# EAGLE board RFWBBoard (EAGLE 6.4)
REV: B; TITLE: Joshua
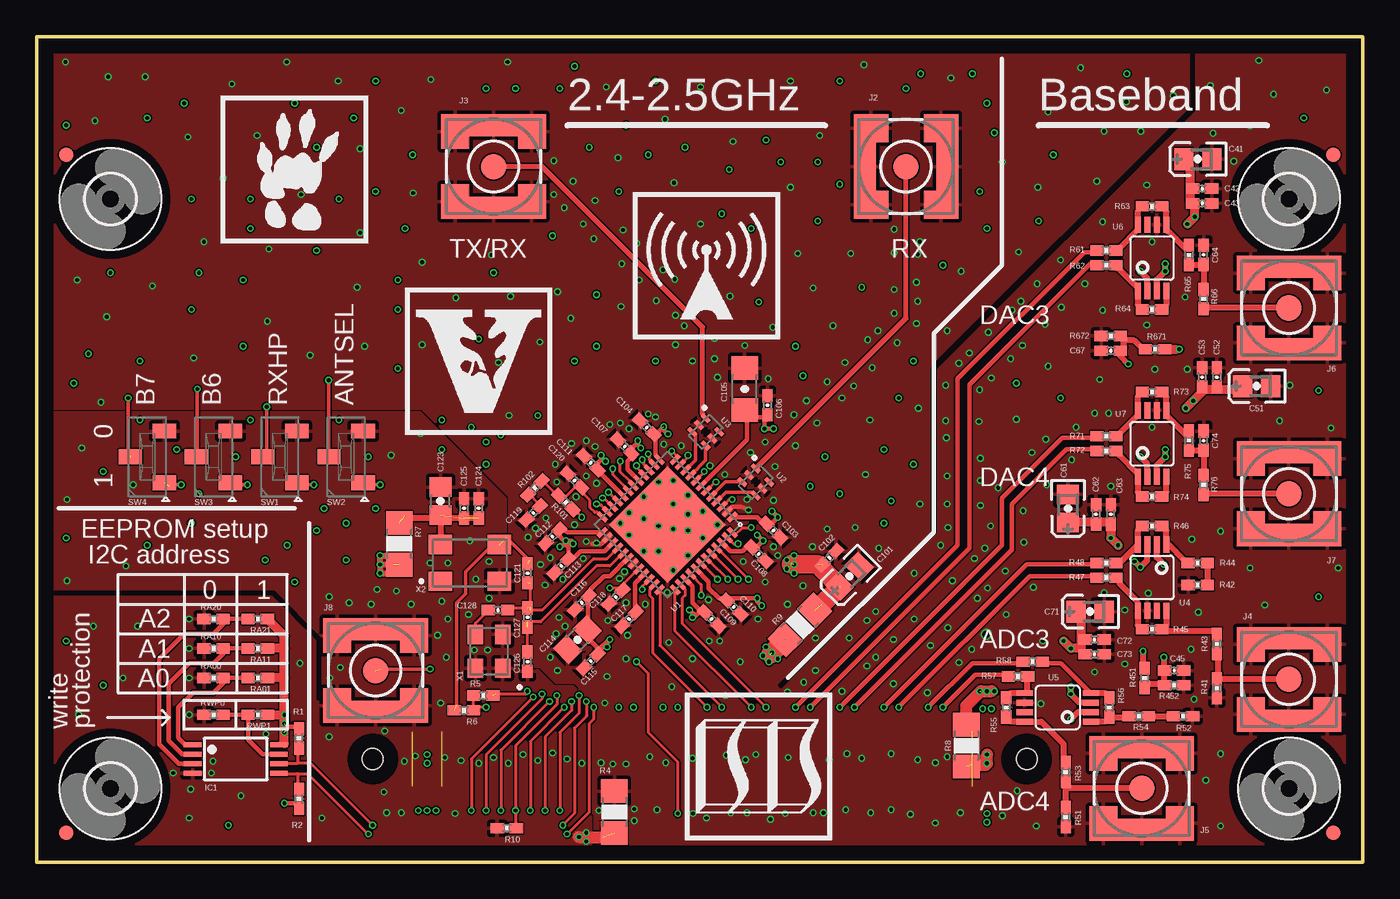
[diagram p7: board, top side]
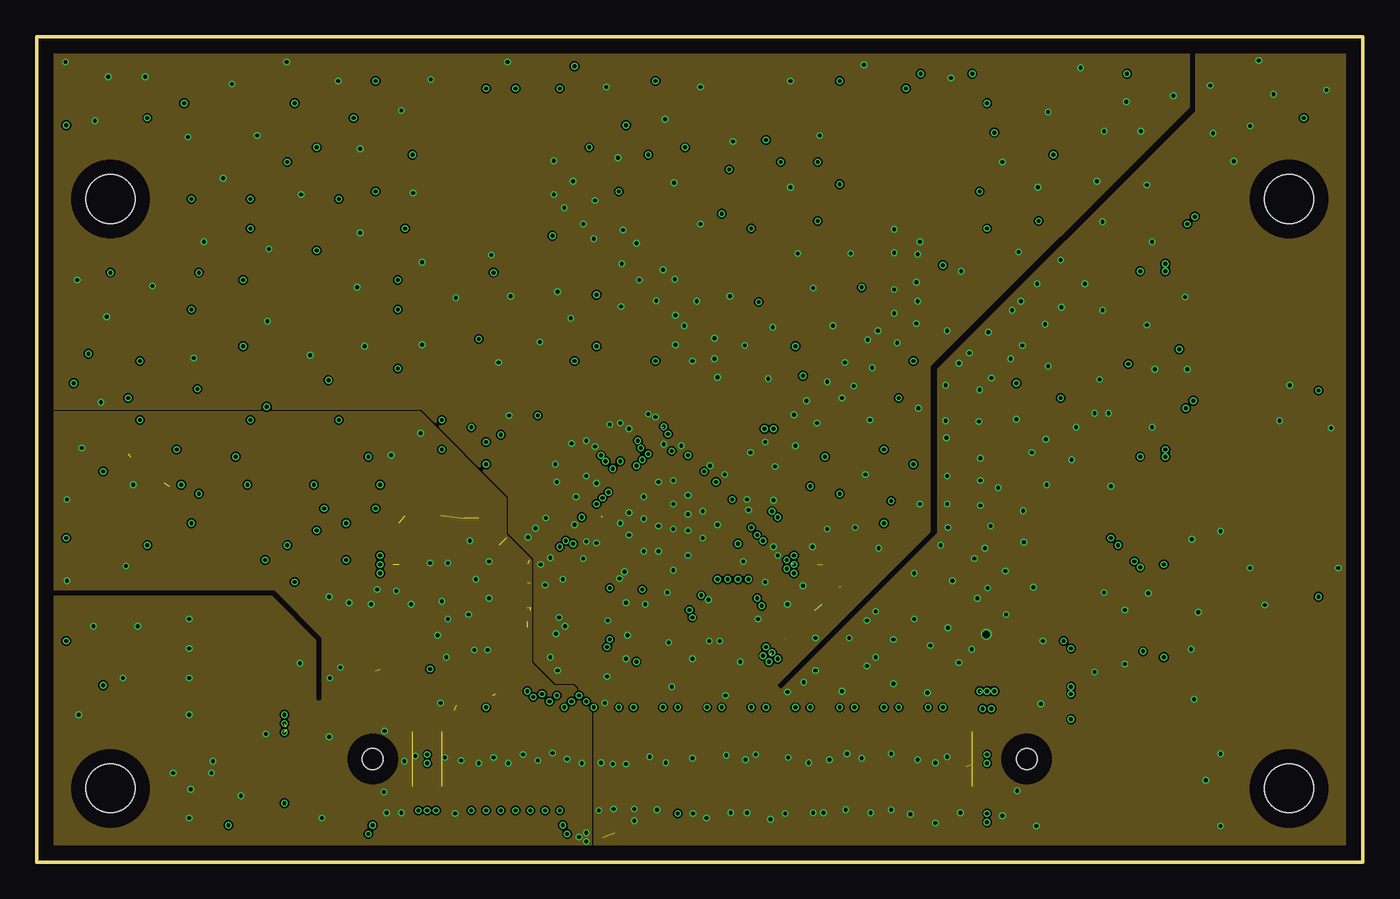
[diagram p8: board, inner layer GND1]
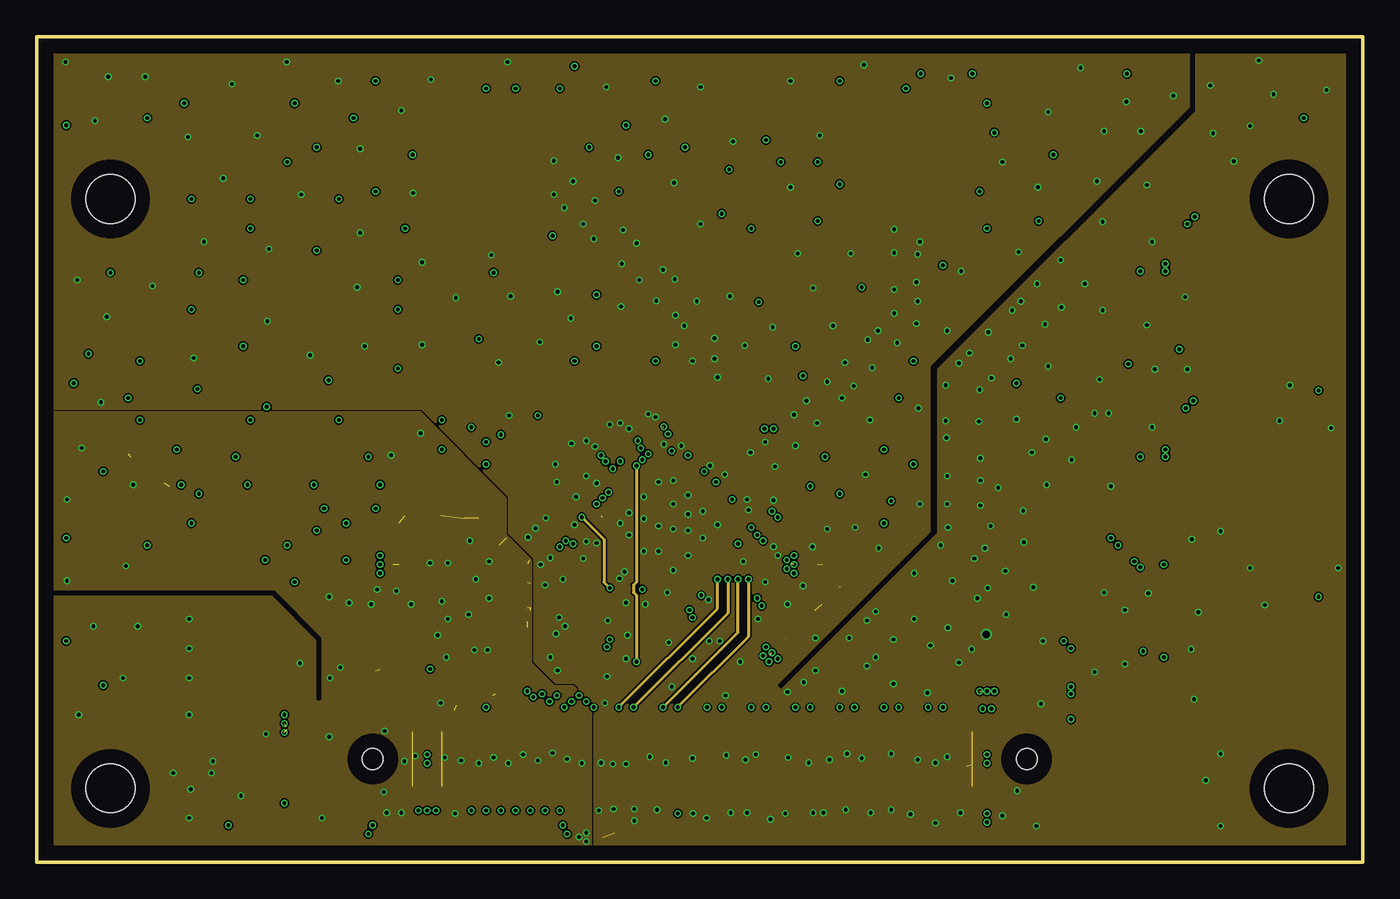
[diagram p9: board, inner layer SIGNAL2]
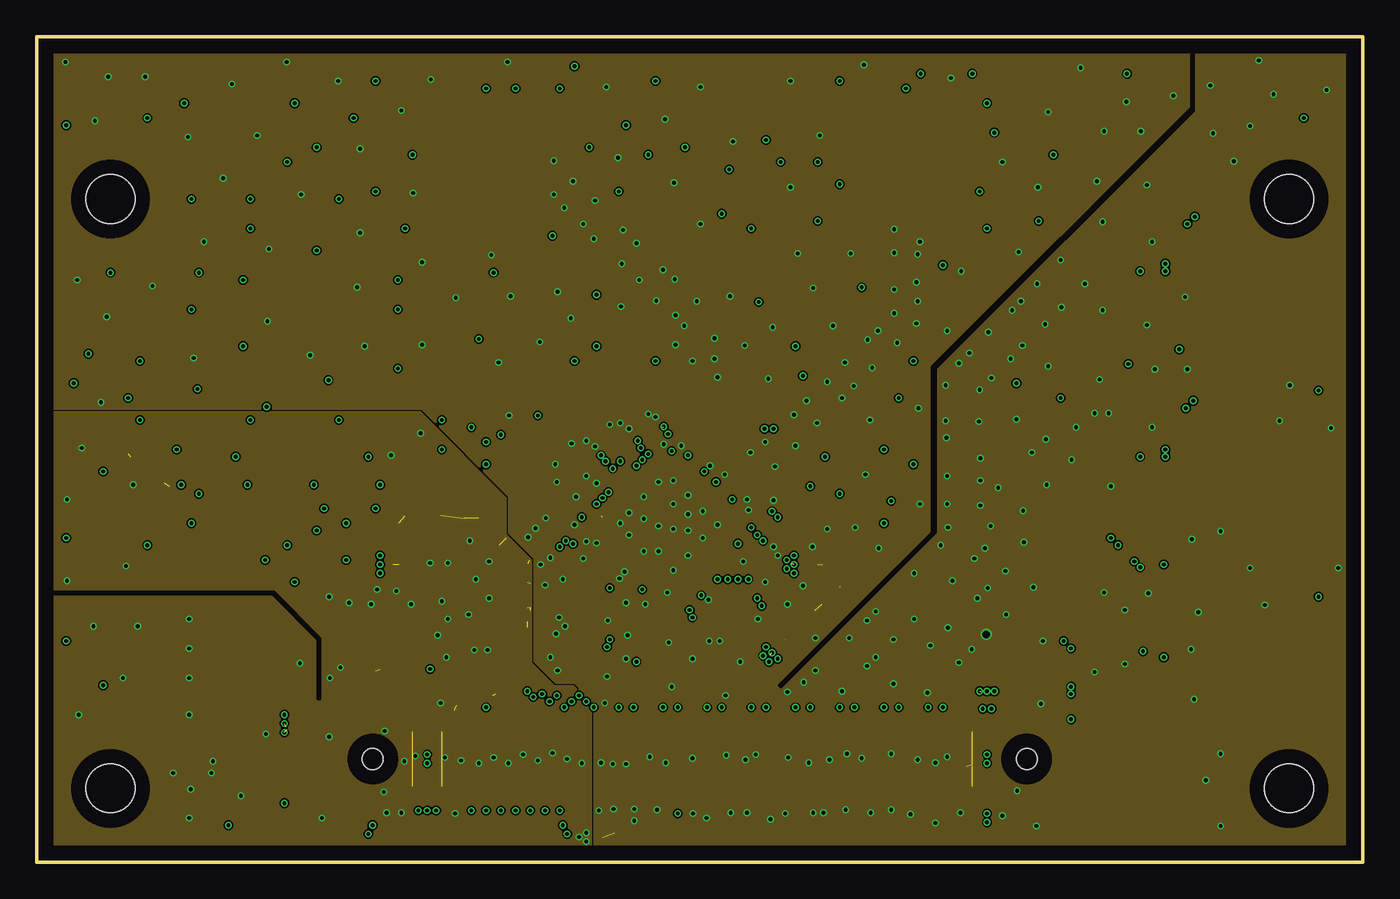
[diagram p10: board, inner layer GND2]
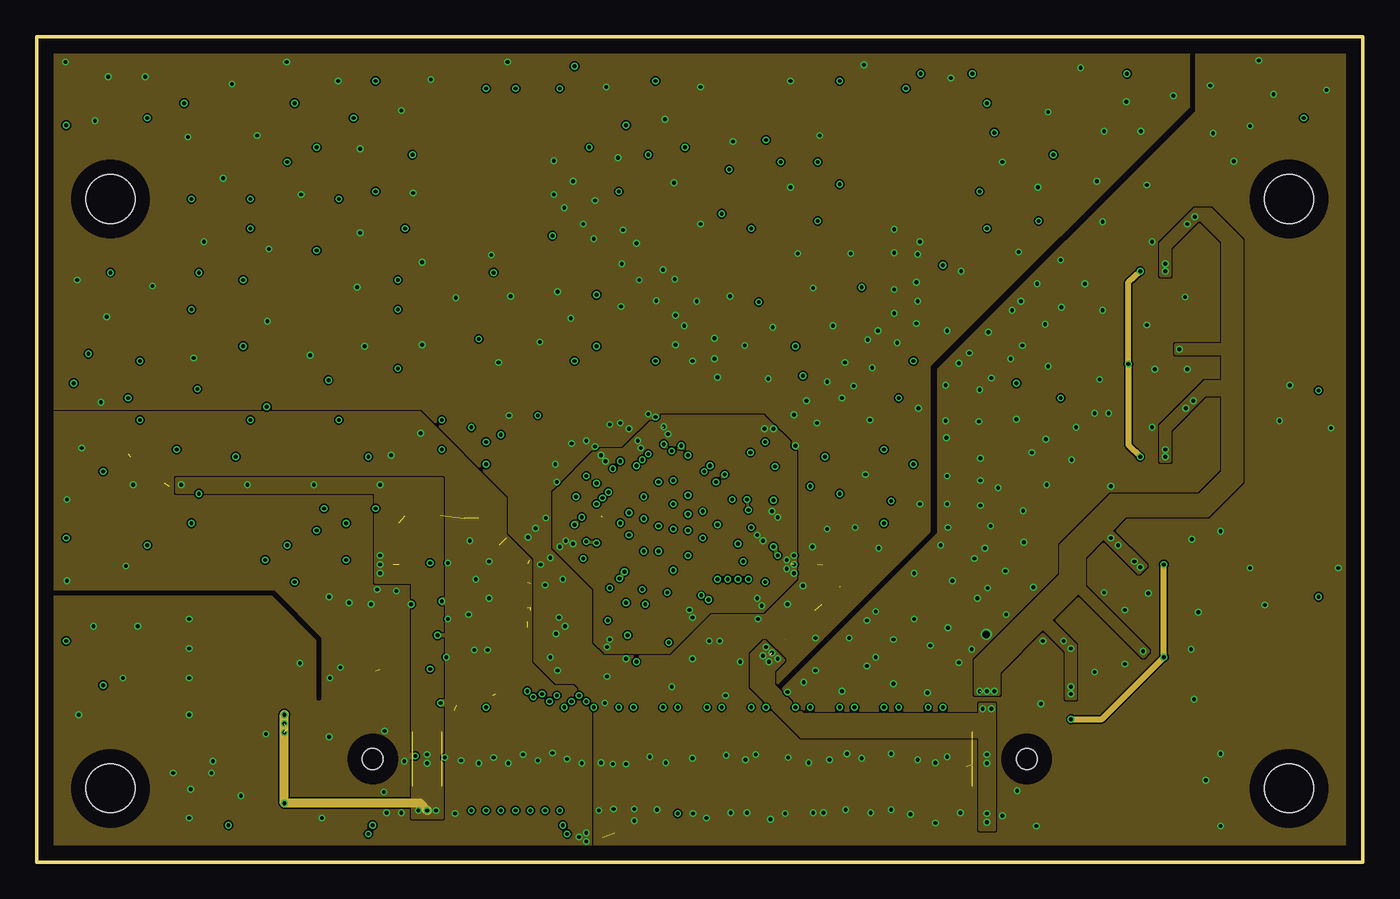
[diagram p11: board, inner layer SUPPLY]
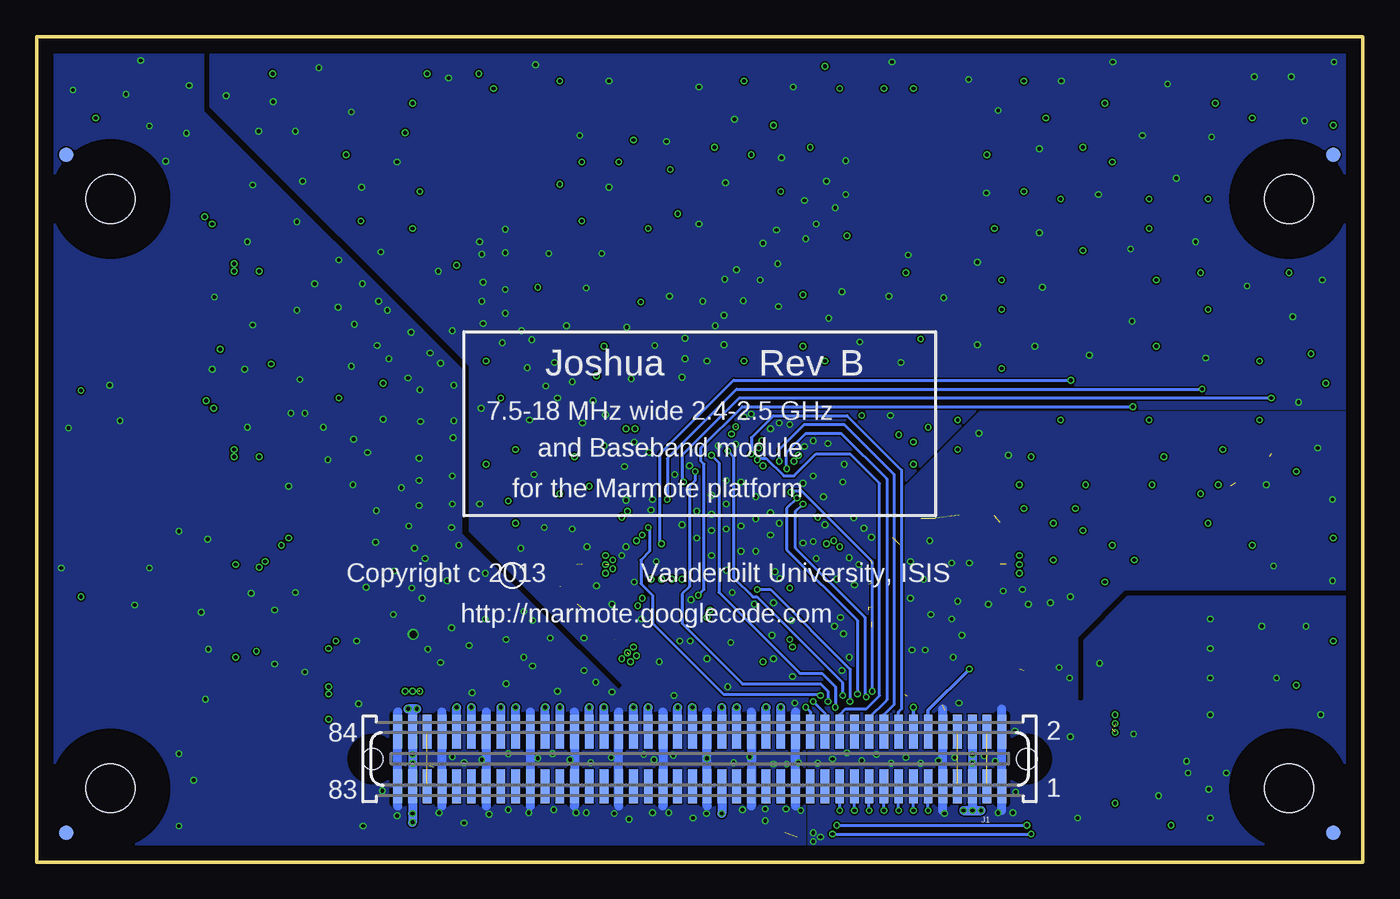
[diagram p12: board, bottom side, seen from below]

Size 90 x 56 mm. Coordinates in mm from the lower left corner, seen from the top.
Outline: 0,0 0,56 90,56 90,0 0,0
Copper layers (1*2*3+14*15*16): SIGNAL1 0.0356mm / dielectric 5mil / GND1 0.0356mm / dielectric 5mil / SIGNAL2 0.0356mm / dielectric 40mil / GND2 0.0356mm / dielectric 5mil / SUPPLY 0.0356mm / dielectric 5mil / GND3 0.0356mm
Design rules "default": minimum track width 4mil, minimum drill 8mil, track to track 4mil, track to pad 4mil, pad to pad 4mil, via to via 4mil, smd to smd 4mil, copper to edge 40mil, drill to drill 8mil, minimum pad ring 10mil, minimum via ring 4mil, stop-mask expansion 2mil, vias tented up to drill 0.5mm, thermal gap 10mil

## Footprints (pad centres in the part's own frame; a part is rotated, then mirrored left to right if it is on the bottom)
CPOL2012 = smd 1.3 x 1.5: + -0.95,0; - 0.95,0
C0402 = smd 0.9 x 0.7: 1 -0.65,0; 2 0.65,0
C1206 = smd 1.6 x 1.803: 1 -1.422,0; 2 1.422,0
C0805 = smd 1.3 x 1.5: 1 -0.95,0; 2 0.95,0
TSSOP8 = smd 0.35 x 1.2: 1 -0.975,-2.925; 2 -0.325,-2.925; 3 0.325,-2.925; 4 0.975,-2.925; 5 0.975,2.925; 6 0.325,2.925; 7 -0.325,2.925; 8 -0.975,2.925
71742-3003-BOT = smd 0.6 x 2.3: 1 -20.5,1.85; 2 -20.5,-1.85; 3 -19.5,1.85; 4 -19.5,-1.85; 5 -18.5,1.85; 6 -18.5,-1.85; 7 -17.5,1.85; 8 -17.5,-1.85; 9 -16.5,1.85; 10 -16.5,-1.85; 11 -15.5,1.85; 12 -15.5,-1.85; 13 -14.5,1.85; 14 -14.5,-1.85; 15 -13.5,1.85; 16 -13.5,-1.85; 17 -12.5,1.85; 18 -12.5,-1.85; 19 -11.5,1.85; 20 -11.5,-1.85; 21 -10.5,1.85; 22 -10.5,-1.85; 23 -9.5,1.85; 24 -9.5,-1.85; 25 -8.5,1.85; 26 -8.5,-1.85; 27 -7.5,1.85; 28 -7.5,-1.85; 29 -6.5,1.85; 30 -6.5,-1.85; 31 -5.5,1.85; 32 -5.5,-1.85; 33 -4.5,1.85; 34 -4.5,-1.85; 35 -3.5,1.85; 36 -3.5,-1.85; 37 -2.5,1.85; 38 -2.5,-1.85; 39 -1.5,1.85; 40 -1.5,-1.85; 41 -0.5,1.85; 42 -0.5,-1.85; 43 0.5,1.85; 44 0.5,-1.85; 45 1.5,1.85; 46 1.5,-1.85; 47 2.5,1.85; 48 2.5,-1.85; 49 3.5,1.85; 50 3.5,-1.85; 51 4.5,1.85; 52 4.5,-1.85; 53 5.5,1.85; 54 5.5,-1.85; 55 6.5,1.85; 56 6.5,-1.85; 57 7.5,1.85; 58 7.5,-1.85; 59 8.5,1.85; 60 8.5,-1.85; 61 9.5,1.85; 62 9.5,-1.85; 63 10.5,1.85; 64 10.5,-1.85; 65 11.5,1.85; 66 11.5,-1.85; 67 12.5,1.85; 68 12.5,-1.85; 69 13.5,1.85; 70 13.5,-1.85; 71 14.5,1.85; 72 14.5,-1.85; 73 15.5,1.85; 74 15.5,-1.85; 75 16.5,1.85; 76 16.5,-1.85; 77 17.5,1.85; 78 17.5,-1.85; 79 18.5,1.85; 80 18.5,-1.85; 81 19.5,1.85; 82 19.5,-1.85; 83 20.5,1.85; 84 20.5,-1.85 | hole 1.4: -22.2,0; 22.2,0
SMA-SMD = smd 1.73 x 1.73: 1 0,0 | smd 2.35 x 1.9: 2@1 -2.375,2.6; 2@2 -2.375,-2.6; 2@3 2.375,-2.6; 2@4 2.375,2.6 | smd 1.5 x 3.4: 2@5 -2.8,0; 2@6 2.8,0
3,3 = hole 3.3: 0,0
FIDUCIAL-1X2 = smd 1 x 1: 1 0,0
R0402 = smd 0.9 x 0.7: 1 -0.65,0; 2 0.65,0
R1206 = smd 1.6 x 1.803: 1 -1.422,0; 2 1.422,0
SWITCH-DIP-CJS = smd 1 x 1.6: 1 -1.75,-1.15; 2 0,1.15; 3 1.75,-1.15
TQFN-48 = smd 0.8 x 0.3: 1 -3.5,2.75; 2 -3.5,2.25; 3 -3.5,1.75; 4 -3.5,1.25; 5 -3.5,0.75; 6 -3.5,0.25; 7 -3.5,-0.25; 8 -3.5,-0.75; 9 -3.5,-1.25; 10 -3.5,-1.75; 11 -3.5,-2.25; 12 -3.5,-2.75; 25 3.5,-2.75; 26 3.5,-2.25; 27 3.5,-1.75; 28 3.5,-1.25; 29 3.5,-0.75; 30 3.5,-0.25; 31 3.5,0.25; 32 3.5,0.75; 33 3.5,1.25; 34 3.5,1.75; 35 3.5,2.25; 36 3.5,2.75 | smd 0.3 x 0.8: 13 -2.75,-3.5; 14 -2.25,-3.5; 15 -1.75,-3.5; 16 -1.25,-3.5; 17 -0.75,-3.5; 18 -0.25,-3.5; 19 0.25,-3.5; 20 0.75,-3.5; 21 1.25,-3.5; 22 1.75,-3.5; 23 2.25,-3.5; 24 2.75,-3.5; 37 2.75,3.5; 38 2.25,3.5; 39 1.75,3.5; 40 1.25,3.5; 41 0.75,3.5; 42 0.25,3.5; 43 -0.25,3.5; 44 -0.75,3.5; 45 -1.25,3.5; 46 -1.75,3.5; 47 -2.25,3.5; 48 -2.75,3.5 | smd 5.6 x 5.6: 49 0,0
LDB21-FOOTPRINT = smd 0.7 x 0.3: 1 -0.65,0.65; 2 -0.65,0; 3 -0.65,-0.65; 4 0.65,-0.65; 5 0.65,0; 6 0.65,0.65
MSOP8 = smd 0.4 x 1.1: 1 -0.975,-2.25; 2 -0.325,-2.25; 3 0.325,-2.25; 4 0.975,-2.25; 5 0.975,2.25; 6 0.325,2.25; 7 -0.325,2.25; 8 -0.975,2.25
CX3225SB = smd 1.3 x 1.05: 1 -1.15,-0.925; 2 1.15,-0.925; 3 1.15,0.925; 4 -1.15,0.925
FOX924 = smd 1.6 x 1.3: 1 -2,-1.25; 2 2,-1.25; 3 2,1.25; 4 -2,1.25

## Placement (x,y rotation side)
C41  10uF  [CPOL2012]  78.8,47.7 0 top
C42  100nF  [C0402]  79.1,45.7 0 top
C43  10nF  [C0402]  79.1,44.7 0 top
C45  100nF  [C0402]  77.2,13 0 top
C51  10uF  [CPOL2012]  82.8,32.3 0 top
C52  100nF  [C0402]  80.1,32.9 90 top
C53  10nF  [C0402]  79.1,32.9 90 top
C61  10uF  [CPOL2012]  70,24 90 top
C62  100nF  [C0402]  71.9,23.6 90 top
C63  10nF  [C0402]  72.9,23.6 90 top
C64  100pF  [C0402]  79.2,41.2 90 top
C67  100nF  [C0402]  72.9,34.7 180 top
C71  10uF  [CPOL2012]  71.5,17 0 top
C72  100nF  [C0402]  71.8,15.1 0 top
C73  10nF  [C0402]  71.8,14.1 0 top
C74  100pF  [C0402]  79.2,28.6 90 top
C101  10uF  [CPOL2012]  55.15,19.4 45 top
C102  100nF  [C0402]  53.8,20.65 45 top
C103  100pF  [C0402]  50,22.5 315 top
C104  DNP  [C0402]  41.4,29.5 135 top
C105  10uF  [C1206]  48.05,32.1 270 top
C106  100pF  [C0402]  49.6,31 270 top
C107  100pF  [C0402]  39.9,28.2 135 top
C108  100pF  [C0402]  49,20.9 315 top
C109  10nF  [C0402]  45.8,16.5 315 top
C110  10nF  [C0402]  47.3,17.3 315 top
C111  10nF  [C0402]  37.6,27.1 135 top
C112  10nF  [C0402]  35,22.1 225 top
C113  10nF  [C0402]  35.6,20.1 225 top
C114  10uF  [C0805]  36.7,15.1 225 top
C115  100nF  [C0402]  37.6,13.65 225 top
C116  100pF  [C0402]  37,17.6 225 top
C117  100nF  [C0402]  40.2,16.5 225 top
C118  68pF  [C0402]  39.3,18 225 top
C119  2200pF  [C0402]  33.7,23.7 225 top
C120  100pF  [C0402]  36.5,25.9 135 top
C121  1000pF  [C0402]  33.3,19.6 90 top
C123  10uF  [C0805]  27.4,24.5 90 top
C124  100nF  [C0402]  30,24 90 top
C125  100pF  [C0402]  29,24 90 top
C126  18pF  [C0402]  33.3,13.6 90 top
C127  33pF  [C0402]  33.3,16.6 90 top
C128  1000pF  [C0402]  31.3,17.1 0 top
IC1  24LC025ST  [TSSOP8]  13.5,7 270 top
J1  CON-71742-3003-BOT  [71742-3003-BOT]  45,7 180 bottom
J2  SMA-SMD  [SMA-SMD]  59,47.2 0 top
J3  SMA-SMD  [SMA-SMD]  31,47.2 90 top
J4  SMA-SMD  [SMA-SMD]  85,12.4 90 top
J5  SMA-SMD  [SMA-SMD]  75,5 90 top
J6  SMA-SMD  [SMA-SMD]  85,37.6 90 top
J7  SMA-SMD  [SMA-SMD]  85,25 90 top
J8  SMA-SMD  [SMA-SMD]  23,13 90 top
LOGO4  LOGO-ISIS-600MIL-10MM-SS  [LOGO-ISIS-10MM-SILKSCREEN]  44,1.5 0 top
LOGO5  LOGO-VANDERBILT-600MIL-10MM-SS  [LOGO-VANDERBILT-10MM-SILKSCREEN]  25,29 0 top
LOGO6  LOGO-MARMOTE-600MIL-10MM-SS  [LOGO-MARMOTE-10MM-SILKSCREEN]  12.5,42 0 top
LOGO7  LOGO-RADIO-3-600MIL-10MM-SS  [LOGO-RADIO-FILLED-10MM-SILKSCREEN]  40.5,35.5 0 top
M1  MOUNT-HOLE3.3  [3,3]  5,45 0 top
M2  MOUNT-HOLE3.3  [3,3]  85,45 0 top
M3  MOUNT-HOLE3.3  [3,3]  5,5 0 top
M4  MOUNT-HOLE3.3  [3,3]  85,5 0 top
M5  FIDUCIAL1X2  [FIDUCIAL-1X2]  2,2 0 top
M6  FIDUCIAL1X2  [FIDUCIAL-1X2]  2,48 0 top
M7  FIDUCIAL1X2  [FIDUCIAL-1X2]  88,48 0 top
M8  FIDUCIAL1X2  [FIDUCIAL-1X2]  88,2 0 top
M9  FIDUCIAL1X2  [FIDUCIAL-1X2]  2,48 0 bottom
M10  FIDUCIAL1X2  [FIDUCIAL-1X2]  88,48 0 bottom
M11  FIDUCIAL1X2  [FIDUCIAL-1X2]  2,2 0 bottom
M12  FIDUCIAL1X2  [FIDUCIAL-1X2]  88,2 0 bottom
R1  4.7k  [R0402]  17.8,8.4 90 top
R2  4.7k  [R0402]  17.8,4.3 270 top
R4  DNP  [R1206]  39.2,3.4 90 top
R5  0  [R0402]  30.3,11.3 0 top
R6  0  [R0402]  29,10.3 180 top
R7  0  [R1206]  24.6,21.6 270 top
R8  0  [R1206]  63.1,7.9 90 top
R9  0  [R1206]  51.8,16.1 45 top
R10  30k  [R0402]  31.9,2.3 180 top
R41  10k  [R0402]  80.1,11.8 90 top
R42  10k  [R0402]  78.8,18.8 0 top
R43  1.58k  [R0402]  80.1,14.8 90 top
R44  1.58k  [R0402]  78.8,20.3 180 top
R45  1.3k  [R0402]  75.7,15.8 180 top
R46  1.3k  [R0402]  75.7,22.8 180 top
R47  49.9  [R0402]  72.6,19.3 180 top
R48  49.9  [R0402]  72.6,20.3 180 top
R51  10k  [R0402]  69.85,3.05 90 top
R52  10k  [R0402]  77.8,9.9 180 top
R53  1.58k  [R0402]  69.85,6.1 90 top
R54  1.58k  [R0402]  74.8,9.9 180 top
R55  1.3k  [R0402]  65.8,10.5 90 top
R56  1.3k  [R0402]  72.8,10.5 90 top
R57  49.9  [R0402]  66.6,12.6 180 top
R58  49.9  [R0402]  67.6,13.6 180 top
R61  40.2k  [R0402]  72.6,41.5 0 top
R62  40.2k  [R0402]  72.6,40.5 0 top
R63  40.2k  [R0402]  75.7,44.5 0 top
R64  40.2k  [R0402]  75.7,37.5 0 top
R65  24.9  [R0402]  78.2,41.2 270 top
R66  24.9  [R0402]  79.2,38.2 270 top
R71  40.2k  [R0402]  72.6,28.9 0 top
R72  40.2k  [R0402]  72.6,27.9 0 top
R73  40.2k  [R0402]  75.7,31.9 0 top
R74  40.2k  [R0402]  75.7,24.8 0 top
R75  24.9  [R0402]  78.2,28.6 270 top
R76  24.9  [R0402]  79.2,25.6 270 top
R101  750  [R0402]  35.9,24.4 315 top
R102  1.2k  [R0402]  33.8,25.4 225 top
R451  10k  [R0402]  75.2,12.5 90 top
R452  10k  [R0402]  77.2,12 180 top
R671  10k  [R0402]  75.9,34.8 0 top
R672  10k  [R0402]  72.9,35.7 0 top
RA00  0  [R0402]  12,12.5 0 top
RA01  DNP  [R0402]  15,12.5 180 top
RA10  0  [R0402]  12,14.5 0 top
RA11  DNP  [R0402]  15,14.5 180 top
RA20  0  [R0402]  12,16.5 0 top
RA21  0  [R0402]  15,16.5 180 top
RWP0  0  [R0402]  12,10 0 top
RWP1  DNP  [R0402]  15,10 180 top
SW1  SWITCH-CJS-1200TA  [SWITCH-DIP-CJS]  16.5,27.5 90 top
SW2  SWITCH-CJS-1200TA  [SWITCH-DIP-CJS]  21,27.5 90 top
SW3  SWITCH-CJS-1200TA  [SWITCH-DIP-CJS]  12,27.5 90 top
SW4  SWITCH-CJS-1200TA  [SWITCH-DIP-CJS]  7.5,27.5 90 top
U1  MAX2830IPC-7351  [TQFN-48]  42.8,22.9 225 top
U2  LDB212G4010C-001  [LDB21-FOOTPRINT]  48.8,25.8 315 top
U3  LDB212G4010C-001  [LDB21-FOOTPRINT]  45.4,29.2 315 top
U4  AD8132MSOP8  [MSOP8]  75.7,19.3 180 top
U5  AD8132MSOP8  [MSOP8]  69.3,10.5 90 top
U6  AD8132MSOP8  [MSOP8]  75.7,41 0 top
U7  AD8132MSOP8  [MSOP8]  75.7,28.4 0 top
X1  CX3225SB  [CX3225SB]  30.7,14.3 90 top
X2  FOX924B  [FOX924]  29.4,20.3 0 top

## Tracks (layer width: path | path; a pad name or v marks a point on that pad's centre or on a via)
!CS  (via drill 0.25)
  SIGNAL1 0.203: v41.1,27.3 41.2,27.2 41.2,27 41.4,26.8 U1.15
  GND3 0.203: v41.1,27.3 41,27.4 40.5,27.4 39.3,26.2 38.6,26.2 37.1,27.7 34.8,27.7 32.8,25.7 32.8,11.3 33.7,10.4 35.1,10.4 35.5,10 J1.24
!SHDN  (via drill 0.25)
  SIGNAL1 0.203: v43.1,27.9 43.5,27.5 U1.12 | v35.3,11.3 35.3,10.7 32.5,7.9 v32.5,3.5 32.5,2.35 R10.1
  GND3 0.203: v43.1,27.9 42.7,27.5 42.7,19.3 41.4,18 41.1,18 35.3,12.2 v35.3,11.3 | v32.5,3.5 J1.17
A0
  SIGNAL1 0.305: RA01.2 RA00.2 12.65,12.15 12,11.5 10.6,11.5 9.6,10.5 9.6,8.45 10.05,8 10.15,8 10.18,7.97 IC1.1
A1
  SIGNAL1 0.305: RA11.2 RA10.2 12.65,14.15 12,13.5 10.35,13.5 8.95,12.1 8.95,8.25 9.88,7.33 IC1.2
A1V5  (1 unrouted)
A2
  SIGNAL1 0.305: RA21.2 RA20.2 12.65,16.15 12,15.5 10,15.5 8.3,13.8 8.3,8 9.62,6.67 IC1.3
A3V3  (via drill 0.25, 0.25 pad 0.25)  (3 unrouted)
  SIGNAL1 0.813: 63.5,6.6 64.4,6.6 v64.5,6.7 v64.5,7.3
  SIGNAL1 1.27: R9.1 49.8,14.1
  GND3 0.61: J1.82 J1.81 v64.5,3.3 v64.5,2.7 | v64.2,10.4 v64.8,10.4 64.5,10.4 64.5,9.85
  other vias: 49.5,14.6 50.3,13.8 49.3,14 49.7,13.6 49.9,14.2
  pour SUPPLY: 65,10.7 65,2.2 64,2.2 64,8.5 51.9,8.5 48.5,11.9 48.5,14.1 49.4,15 50.7,13.7 50,13 50,12 52,10 64,10 64,10.7
A3V3_BB  (via drill 0.25, 0.25 pad 0.25)  (1 unrouted)
  SIGNAL1 0.203: C62.1 C63.1 | 72.9,23.1 C63.1 | C63.1 72.9,22.5 | R451.2 75.1,13.5 | 75.1,14.1 v75.1,14.3 | C72.1 70.9,15 | 70.9,14.5 C73.1 | 70.9,16.9 C71.+ | C51.+ 81.4,32.1 | C52.1 C53.1 79.3,32.1 | v77.55,34.8 77.3,34.8 | 76.9,34.8 R671.2 | 78.6,44.5 C43.1 78.3,44.9 C42.1 | 78.3,47 C41.+ | 70.2,23.1 C61.+
  SIGNAL1 0.406: v76.6,40.6 v76.6,40.1 76.03,39.52 U6.3 | v76.6,28 v76.6,27.5 76.03,26.93 U7.3 | v74.5,20.4 v74.9,20 75.38,20.48 U4.3 | v70.2,11.9 v70.2,11.4 70.78,10.82 U5.3 | 75.1,13.5 75.1,14.1
  SIGNAL1 0.61: 76.9,34.8 77.3,34.8 | v78.1,43.3 v78.6,43.8 78.6,44.5 | 78.3,44.9 78.3,47 | 81.4,32.1 79.3,32.1 v78.5,31.3 v78,30.8 | 70.2,23.1 72.9,23.1 | 72.9,22.5 v72.9,22 v73.4,21.5 | 70.9,16.9 70.9,15 70.9,14.5 v70.2,14.5 v69.7,15
  SIGNAL1 0.813: R8.2 63.1,10.6 64.1,11.6 64.8,11.6
  other vias: 64.5,11.6 64,11.6 65,11.6
  pour SUPPLY: 76.9,39.8 76.3,39.8 76.3,42 78.6,44.3 79.7,44.3 81.8,42.2 81.8,25.8 79.5,23.5 73.9,23.5 72.9,22.5 75.3,20.1 74.8,19.6 72.4,22 71.1,20.7 71.1,18.7 75.5,14.3 75.1,13.9 70.7,18.3 68.8,16.4 70.5,14.7 70.5,11.1 69.9,11.1 69.9,14.3 68.3,15.9 65.3,12.9 65.3,11.4 63.7,11.4 63.7,13.7 69.5,19.5 69.5,21.5 72.9,24.9 78.9,24.9 80.5,26.5 80.5,31.7 79.3,31.7 76.9,29.3 76.9,27.2 76.3,27.2 76.3,29.6 79.3,32.6 80.5,32.6 80.5,34.5 77.3,34.5 77.3,35.1 80.5,35.1 80.5,42.1 79,43.6 78.8,43.6 76.9,41.7
A3V3_RF  (via drill 0.25)  (5 unrouted)
  SIGNAL1 0.203: C106.2 49.5,30.35 49.5,30.2 | 49.5,30.2 49.5,30 | 49.4,30 49.6,30 C106.2 | 49.5,30.2 49.6,30.2 C106.2 | 48.5,30.2 48.2,30.2 | 48.2,30.2 48.2,30 | 48.2,30.2 48.05,30.2 C105.2 | 54.7,18.9 54.5,18.7 | 52.3,19.9 52.3,19.7 53,20.2 | 49.2,23.1 49.4,23.1 C103.1 49.7,22.8 | 49.7,22.8 | 48.8,21.3 48.58,21.4 C108.1 48.5,21.4 48.2,21.4 | 46.3,17.9 46.75,17.85 C110.1 | 45,17.1 45.2,17.1 C109.1 45.3,17 45,17 | 44.6,16.6 v44.5,16.6 | 37.4,15.2 C114.1 | 38.2,14.4 C115.1 | 37.6,18.5 C116.1 37.4,18 | 36.5,20.7 C113.1 36.1,20.9 | 35.6,21.5 v35.5,21.4 | 36.3,21.8 v36.4,21.6 | 35.3,22.3 C112.1 35.7,22.7 | 38.3,22.3 U1.25 | C111.1 38,27 | 38.4,27.4 v38.3,27.6 | 40.3,27.4 C107.1 40.35,28.05 | 40.7,28.4 v40.8,28.6 | 42.15,27.44 42,27.6 | 42,28.9 C104.1 42.05,29.05 | U1.1 47.2,23.4
  SIGNAL1 0.305: 48.2,30.15 48.2,30 48.2,28.65 U1.7 | v50,29.4 v49.4,29.4 49.4,30 | U1.13 42.15,27.44 | 42,27.6 42,28.9 | v42.55,29.55 42.55,29.35 42.9,29 | 42.5,29.5 42.05,29.05 | 42.05,29.05 | 36.1,20.9 36.1,21.5 35.6,21.5 | U1.17 40.1,26.66 40.1,27.2 40.3,27.4 | 40.2,28 40.35,28.05 40.7,28.4 v41,28.1 | 38,27 38.4,27.4 | 49.2,21.9 v48.9,22.2 v49.3,21.8 48.8,21.3 | 35.7,22.7 36,22.4 38.2,22.4 38.3,22.3 | 37.6,18.5 38.5,19.4 38.9,19.4 40.1,20.6 U1.30 | 45,17.1 44.5,17.6 44.5,18.73 U1.39 | U1.41 45.6,19.04 45.6,18.6 46.3,17.9 v48.9,17.9 48.9,17.7 v49.2,17.4 | U1.1 47.29,23.5 | 47.2,23.4 48.9,23.4 49.2,23.1 | 48.2,21.4 47.9,21.1 47.08,21.1 U1.46 | 44.6,16.8 v44.3,17.1 44.7,16.7 45,17 | 36.3,21.8 35.8,21.8 35.3,22.3 | 36.5,20.7 36.9,21.1 38.52,21.1 U1.27 | 37.4,18 37.4,15.2 38.2,14.4 | 49.5,30.2 48.5,30.2 | 49.7,22.8 v50.3,23.4 v49.9,23.8 | U1.20 38.06,26.58 C111.1
  SIGNAL1 0.406: 38.2,14.4 v38.9,15.1
  SIGNAL1 1.27: 53.3,17.5 54.5,18.7 53,20.2 51.2,20.2
  other vias: 35.9,21.8 38.6,27.2 42.85,29.05 38.7,14.6 51.4,20.8 51.4,19.6 50.9,19.9 50.9,20.5 51.4,20.2
  pour SUPPLY: 35.1,25.1 38,28 39.8,28 42.1,30.3 49.3,30.3 51.5,28.1 51.5,19.2 49.3,17 45.7,17 42.9,14.2 38.6,14.2 37.9,14.9 37.9,18.5 35.1,21.3
ADC3+  (via drill 0.25)
  SIGNAL1 0.203: 71.8,19.4 R47.2
  SIGNAL1 0.305: 71.8,19.4 67.4,19.4 v58.5,10.5
  GND3 0.61: J1.70 v58.5,10.5
ADC3-  (via drill 0.25)
  SIGNAL1 0.203: R48.2 72,20.2
  SIGNAL1 0.305: v57.5,10.5 67.2,20.2 72,20.2
  GND3 0.61: J1.68 v57.5,10.5
ADC4+  (via drill 0.25)
  SIGNAL1 0.203: 65.7,12.7 R57.2
  SIGNAL1 0.305: 65.7,12.7 63.7,12.7 v61.5,10.5
  GND3 0.61: J1.76 v61.5,10.5
ADC4-  (via drill 0.25)
  SIGNAL1 0.203: R58.2 66.7,13.5
  SIGNAL1 0.305: 66.7,13.5 63.5,13.5 v60.5,10.5
  GND3 0.61: J1.74 v60.5,10.5
AGND  (via drill 0.25, 0.25 pad 0.25, 0.5)
  SIGNAL1 0.305: 38.72,22.02 U1.26 38.32,21.6 37.7,21.6 | U1.2 47.18,24.1 47.8,24.1 v48.3,23.9 | U1.31
  GND3 0.61: 65.5,3.8 65.5,10.2 | 62.5,3.8 62.5,10.2 | 59.5,10.2 59.5,3.8 | 56.5,3.8 56.5,10.2 | 53.5,10.2 53.5,3.8 | 50.5,3.8 50.5,10.2 | 47.5,10.2 47.5,3.8 | 44.5,3.8 44.5,10.2 | 41.5,10.2 41.5,3.8 | 38.5,3.8 38.5,10.2
  other vias: 43.2,25.9 43.2,24.3 45.2,22 42.2,21.1 42.2,25.8 39.6,23 41.2,24.8 44.2,23.6 44.2,24.9 45.2,23.8 40.2,23.7 46.2,22.9 43.2,19.8 40.2,22.2 44.2,22.5 44.2,20.8 48.05,35.05 37.3,21.75 39.55,19.25 44.5,13.8 41.5,30.4 35.2,27 45.65,15 47.95,20.4 48.95,16.5 66.55,4.85 61.8,7.15 59.8,6.95 56,7.05 53.8,6.95 51,7.1 48.1,6.95 44.5,7.05 41.6,7.15 43.75,28.25 34.55,23.35 34.85,20.65 49.65,32.8 46.2,32.9 40.9,39.5 39.7,40.6 37.8,42.3 37.1,43.3 35.8,44.4 35.1,45.3 42.5,40.2 40.7,42 39.8,42.9 37.9,44.9 36.4,46.2 35.1,47.6 50.1,26.85 49.45,28.5 52.7,38.95 58.2,38.85 58.2,41.35 58.2,42.95 51.5,28.25 61.8,36.05 59.8,38.05 59.7,39.35 59.8,41.25 43.3,39.55 75.7,42.1 75.7,29.5 75.45,18.25 66.95,23.85 62.6,13.55 60.45,11.5 71.8,12.9 61.8,24.3 58.15,12.1 61.85,15.9 63.85,17.9 64.55,18.6 67,21.7 61.8,26.2 68.5,28.7 72.9,25.5 65.8,16.8 78.4,21.9 68.3,15 78.55,11.05 72.15,32.75 73.85,13.45 64.05,25.9 63.95,29.9 70.25,27.3 72.75,30.45 54.65,11.6 56.35,13.3 56.95,13.9 58.15,15.1 59.55,16.5 62.15,19.1 63.65,20.6 64.35,21.3 64.75,22.8 68.55,25.6 70.55,29.5 52.05,12.2 52.85,13 55.15,15.2 56.35,16.4 56.95,17 59.55,19.6 61.35,21.5 61.85,22.7 64.05,24.2 65.25,25.4 67.55,27.8 68.45,36.5 64,32.05 71.8,30.45 75.9,33.45 62.6,33.85 66.5,30.05 71.15,39.25 66.1,34.15 64.8,32.85 66.9,35.05 61.7,29.95 61.7,32.35 1.95,54.3 10.25,49.2 13.25,52.8 16.95,54.3 20.45,53 26.75,53.1 31.95,54.3 38.65,52.6 45.05,52.6 51.15,53 56.15,54.1 62.05,53.2 70.85,53.9 68.65,50.9 73.95,51.6 79.65,52.7 82.95,54.4 87.55,52.4 3.95,50.3 7.35,53.3 14.95,49.3 21.95,48.4 24.75,51 43.25,46.1 47.25,48.9 53.15,49.3 65.55,47.5 67.95,45.8 71.95,46.2 77.15,52 83.95,52.1 12.65,46.4 21.95,42.7 25.55,45.4 39.45,47.8 59.95,42.1 51.15,45.8 66.65,41.4 74.95,49.6 72.45,49.6 2.75,39.5 15.75,41.6 35.35,38.7 26.15,40.7 30.85,41.2 62.75,40.1 4.75,37 10.65,34.2 15.65,36.7 21.75,39 49.95,36.3 64.05,27.4 4.35,31.2 59.85,30.8 59.95,24.3 55.55,22.7 60.65,14.7 56.25,26.3 39.15,3.6 38.15,3.5 44.55,3.3 35.45,16.6 38,21.65 38.9,29.7 38,25.7 36.3,28.4 47.1,3.35 50.8,3.3 53.4,3.35 56.6,3.35 59.3,3.25 62.7,3.35 64.45,15.45 63.45,14.45 65.55,3.15 46.75,11.3 38.55,10.8 50.95,11.55 56.55,30 61.75,28.8 51.65,41.3 55.25,41.3 54.05,36.4 47.05,38.4 45.05,43.3 42.65,50.4 39.65,37.7 36.25,36.9 34.15,35.3 32.15,38.4 26.15,35.1 28.45,38.3 11.35,42.1 7.85,39.1 22.25,35 43.35,35.1 50,21.4 50.3,20.8 38.3,6.75 43.2,22.6 41.2,21.1 42.8,18.3 41.3,17.5 39.9,19.7 34.5,18.8 37.1,20.6 35.7,19.2 34.2,20.2 45.6,17.8 36.6,24.8 40,17.6 51.4,30.35 52.95,29.8 52.25,31.3 53.65,32.6 55.45,32.3 54.65,31.5 54.85,33.9 56.4,35.45 56.7,33.55 58.4,35.25 57.1,36.05 59.7,36.55 58.2,37.25 40.1,15.4 40,13.8 35.25,15.5 38.75,16.4 48.45,27.8 45.7,26.9 46.7,26.3 50,24.55 53.65,22.6 57.15,21.3 52.65,21.4 52,18.75 44.8,38.05 46,35.55 46,34.15 44.5,34 43.95,36.4 43.35,37.1 42.05,38.1 32.05,30.3 31.35,33.9 18.55,34.4 17.95,45.3 78.35,14.45 80.35,7.35 68.15,10.75 69.55,37.65 85.05,32.35 77.95,38.35 78.85,16.95 67.65,18.65 87.85,29.45 84.35,29.95 65.75,19.75 88.35,19.95 80.35,22.45 82.35,19.95 68.65,33.65 83.35,17.45 79.35,5.55 80.35,2.45 67.85,2.45 63.3,34.55 64.6,35.95 66.2,37.45 66.8,38.05 67.9,39.25 69.5,40.85 75.35,36.45 82.35,49.95 75.35,45.95 72.35,43.45 72.35,37.45 79.85,49.45 81.25,47.55 73.85,17.1 72.45,18.3 78.1,33.45 41.2,23.3 42.2,22.8 40.2,29.4 42,30.2 35.85,16 43.1,11.9 46.35,15 48.2,24.6 42.55,28.35 39.6,29.8 37.9,28.2 37.3,28.6 37.3,26.2 35.3,25.8 33.35,22.05 33.85,22.65 36.5,22.9 42.9,14.9 34.85,13.9 35.35,13 38.7,12.6 40,6.65 42.7,6.75 46.8,7.25 48.8,7.3 52.4,6.75 55,7.35 58,7.35 61,6.75 61,2.65 58,3.55 54.9,3.55 52.7,3.35 49.8,2.9 48.2,3.35 45.45,3 40.55,3.6 40.55,2.8 42.1,3.55 39.1,6.65 50.95,17.5 49.45,19 47.75,13.6 52.85,15.2 4.85,53.3
  pour SIGNAL1 (rank 2): 0,56 90,56 90,0 0,0
  pour SIGNAL2 (rank 2): 0,56 90,56 90,0 0,0
  pour GND1 (rank 2): 0,56 90,56 90,0 0,0
  pour GND3 (rank 2): 0,56 90,56 90,0 0,0
  pour GND2 (rank 2): 0,56 90,56 90,0 0,0
  pour SUPPLY (rank 3): 0,56 90,56 90,0 0,0
ANTSEL  (via drill 0.25, 0.25 pad 0.25)
  SIGNAL1 0.203: v47.6,21.6 47.3,21.6 47.1,21.8 U1.47
  SIGNAL1 0.254: v19.8,32.7 19.8,27.55 SW2.2
  GND3 0.203: v47.6,21.6 47.7,21.7 47.7,27.7 42.7,32.7 v19.8,32.7
B1  (via drill 0.25)
  SIGNAL1 0.203: U1.23 38.3,24.22 38.08,24.22 v38,24.3 | v33.7,11.2 29.5,7 v29.5,3.5
  GND3 0.203: v33.7,11.2 33.8,11.3 33.8,16.6 38.5,21.3 38.5,23.8 v38,24.3 | v29.5,3.5 J1.11
B2  (via drill 0.25)
  SIGNAL1 0.203: U1.11 44.2,27.48 v44.2,27.6 | v35.8,10.5 33.5,8.2 v33.5,3.5
  GND3 0.203: v35.8,10.5 35.8,11.9 36.7,12.8 38.2,12.8 43.7,18.3 43.7,27.1 v44.2,27.6 | v33.5,3.5 J1.19
B3  (via drill 0.25)
  SIGNAL1 0.203: U1.8 45.3,26.46 v45.3,26.5 | v36.3,10.9 36.3,10.3 34.5,8.5 v34.5,3.5
  GND3 0.203: v45.3,26.5 45.3,25.9 45.7,25.5 45.7,18.7 46.2,18.2 46.2,16.2 42.1,12.1 36.8,12.1 36.3,11.6 v36.3,10.9 | v34.5,3.5 J1.21
B4  (via drill 0.25)
  SIGNAL1 0.203: U1.34 41.1,18.73 v41.1,18.5 | v34.8,10.9 31.5,7.6 v31.5,3.5
  GND3 0.203: v41.1,18.5 40.2,18.5 34.8,13.1 v34.8,10.9 | v31.5,3.5 J1.15
B5  (via drill 0.25)
  SIGNAL1 0.203: U1.14 41.6,27.28 41.6,27.6 v41.5,27.7
  GND3 0.203: v41.5,27.7 41.5,28.8 40,30.3 35,30.3 31.3,26.6 31.3,10.4 31.5,10.2 J1.16
B6  (via drill 0.25, 0.25 pad 0.25)
  SIGNAL1 0.203: U1.3 46.98,24.6 v47.2,24.6
  SIGNAL1 0.254: v10.9,32.1 10.9,27.55 SW3.2
  GND3 0.203: v10.9,32.1 42.5,32.1 47.2,27.4 v47.2,24.6
B7  (via drill 0.25, 0.25 pad 0.25)  (1 unrouted)
  SIGNAL1 0.203: U1.6 46.05,25.8 v46.1,25.8
  SIGNAL1 0.254: v6.2,31.5 6.2,27.7 6,27.5
  GND3 0.203: v6.2,31.5 42.3,31.5 46.2,27.6 46.2,25.9 v46.1,25.8
BYPASS
  SIGNAL1 0.203: 40.6,17.15 C117.1 | 41.1,19.43 U1.33
  SIGNAL1 0.305: 40.6,17.15 40.6,18.93 41.1,19.43
CLK_EXT  (via drill 0.25)  (1 unrouted)
  SIGNAL1 0.254: v26.7,13.1 23.3,13.1
  GND3 0.254: J1.12 29.5,10.3 v26.7,13.1
CLK_LOC  (via drill 0.25)
  SIGNAL1 0.203: v30.5,10.5 29.85,10.5 R6.1 R5.1
  GND3 0.254: J1.14 v30.5,10.5
D1V5  (1 unrouted)
D3V3  (via drill 0.25)  (4 unrouted)
  SIGNAL1 0.203: v16.8,10 17,10 17,9.2 | 16.9,9.2 17,9.2 | 17,9.2 17,9 | 16.8,8.05 16.43,8.05 IC1.8 | 17.85,9.2 R1.2 | 17.45,4 R2.2
  SIGNAL1 0.254: v9.8,25.6 9.1,25.6 9,25.5 | v14.3,25.6 13.3,25.6 SW3.1 | v18.8,25.6 17.8,25.6 SW1.1 | v23.3,25.6 22.3,25.6 SW2.1
  SIGNAL1 0.305: v16.8,4 17.45,4 | 16.9,9.2 17.85,9.2
  SIGNAL1 0.406: v23.3,20.2 v23.3,20.8 23.7,20.8 | v23.3,20.2 v23.3,19.6 24.6,19.6 | v23.3,20.2 24.2,20.2 | 24.58,20.2 R7.2
  SIGNAL1 0.61: RWP1.1 v16.8,10 | RA21.1 16.8,15.35 16.8,14.5 | 16.8,8.05 v16.8,10 | 16.8,12.5 16.8,14.5 | v16.8,10 16.8,12.5 | 16.8,14.5 RA11.1 | 16.8,12.5 RA01.1
  SUPPLY 0.61: v26.5,3.5 26,4 v16.8,4 v16.8,10
  GND3 0.61: J1.6 J1.5 v26.5,3.5 | v26.5,3.5 v25.9,3.5 v27.1,3.5 v26.5,3.5
  other vias: 16.8,9.4 16.8,8.8 26.5,7.3 26.5,6.7
  pour SUPPLY: 23,25.1 9.5,25.1 9.5,26 27.5,26 27.5,3 25.5,3 25.5,19 23,19
DAC3+  (via drill 0.25)
  SIGNAL1 0.203: R62.1 71.9,40.6
  SIGNAL1 0.305: v52.5,10.5 63.3,21.3 63.3,32.4 71.5,40.6 71.9,40.6
  GND3 0.61: J1.58 v52.5,10.5
DAC3-  (via drill 0.25)
  SIGNAL1 0.203: 71.8,41.4 R61.1
  SIGNAL1 0.305: v51.5,10.5 62.5,21.5 62.5,32.8 71.1,41.4 71.8,41.4
  GND3 0.61: J1.56 v51.5,10.5
DAC4+  (via drill 0.25)
  SIGNAL1 0.203: R72.1 71.8,28
  SIGNAL1 0.305: v55.5,10.5 66.2,21.2 66.2,24.3 69.9,28 71.8,28
  GND3 0.61: J1.64 v55.5,10.5
DAC4-  (via drill 0.25)
  SIGNAL1 0.203: 71.8,28.8 R71.1
  SIGNAL1 0.305: v54.5,10.5 65.5,21.5 65.5,24.7 69.6,28.8 71.8,28.8
  GND3 0.61: J1.62 v54.5,10.5
DGND  (via drill 0.25)  (1 unrouted)
  SIGNAL1 0.813: v36.8,1.7 38.4,1.7
  GND3 0.61: 24.5,3.5 24.5,10.4 | 28.5,3.5 28.5,10.4
  other vias: 10.35,10 10.35,14.5 10.35,16.5 10.35,12.5 11.85,6.05 23.55,4.75 28.4,3.3 24.75,3.35 24.95,6.85 28.8,6.9 27.7,7.1 6.85,16 5.85,12.5 3.85,16 2.85,10 13.85,4.5 10.35,3 19.35,3 19.85,8.5 37.3,1.4 37.3,2 25.7,7.2 15.55,8.7 3.05,28.1 2.05,24.6 6.55,25.6 26.05,29.1 24.05,27.6 6.05,20.1 2.05,19.1 19.85,18 17.85,13.5 30,6.7 31,7.1 32,6.7 33,7.3 35,7.4 34,6.9 36,7 37,6.7 23.6,8.9 23.75,3.35 27.4,10.8 30.6,14.4 29.7,14.4 29.3,16.8 30.7,17.9 29.8,19.2 30.7,20.4 29.4,21.8 27.9,20.3 27.5,17.7 26.7,20.3 27.9,16.5 27.2,15.4 27.8,13.9 20.6,13.2 19.9,12.5 21.2,17.6 23.1,18.5 22.7,17.5 25.4,17.5 24.4,18.4 11.95,6.85 10.45,4.95 9.25,6.05
  pour SIGNAL1: 0,0 37.6,0 37.6,10.7 36.4,11.9 35.1,11.9 33.5,13.5 33.5,20.5 31.8,22.2 31.8,24.7 26,30.5 0,30.5
  pour GND1: 0,0 37.6,0 37.6,10.7 36.4,11.9 35.1,11.9 33.5,13.5 33.5,20.5 31.8,22.2 31.8,24.7 26,30.5 0,30.5
  pour SIGNAL2: 0,0 37.6,0 37.6,10.7 36.4,11.9 35.1,11.9 33.5,13.5 33.5,20.5 31.8,22.2 31.8,24.7 26,30.5 0,30.5
  pour GND3: 0,0 37.6,0 37.6,10.7 36.4,11.9 35.1,11.9 33.5,13.5 33.5,20.5 31.8,22.2 31.8,24.7 26,30.5 0,30.5
  pour SUPPLY (rank 2): 0,0 37.6,0 37.6,10.7 36.4,11.9 35.1,11.9 33.5,13.5 33.5,20.5 31.8,22.2 31.8,24.7 26,30.5 0,30.5
  pour GND2: 0,0 37.6,0 37.6,10.7 36.4,11.9 35.1,11.9 33.5,13.5 33.5,20.5 31.8,22.2 31.8,24.7 26,30.5 0,30.5
DIN  (via drill 0.25)
  SIGNAL1 0.203: v39.1,26.7 39.1,26.3 40,25.4 U1.19
  GND3 0.203: v39.1,26.7 39.1,27.8 37.8,29.1 35.4,29.1 32.3,26 32.3,11 33.5,9.8 J1.20
I2C_SCL  (via drill 0.25, 0.25 pad 0.25)
  SIGNAL1 0.203: v37.3,10.9 37.3,9.9 36.5,9.1 36.5,3.3 v35.7,2.5 | v22.8,2.5 18.6,6.7 17.7,6.7 | 17.7,6.7 16.8,6.7 IC1.6 | 17.7,6.7 17.7,7.6 17.8,7.6 R1.1
  GND3 0.203: v35.7,2.5 v22.8,2.5 | v37.3,10.9 36.5,10.1 J1.26
I2C_SDA  (via drill 0.25, 0.25 pad 0.25)
  SIGNAL1 0.203: v37.8,10.5 37.8,9.7 37.5,9.4 37.5,3.4 v36,1.9 | 17.7,6 16.8,6 IC1.5 | 17.7,6 18.4,6 v22.5,1.9 | 17.7,6 17.7,4.95 R2.1
  GND3 0.203: v36,1.9 v22.5,1.9 | v37.8,10.5 37.5,10.2 J1.28
LD  (via drill 0.25)
  SIGNAL1 0.203: v38.4,24.7 38.5,24.7 38.9,24.3 U1.22 | v34.3,11.4 34.3,11.1 30.5,7.3 v30.5,3.5
  GND3 0.203: v38.4,24.7 39.1,24 39.1,21.2 34.3,16.4 v34.3,11.4 | v30.5,3.5 J1.13
N$1
  SIGNAL1 0.254: U2.4 48.58,25.1 46.77,25.1 U1.4
N$2
  SIGNAL1 0.254: U1.5 46.76,25.8 U2.3
N$3
  SIGNAL1 0.254: U1.10 44.7,27.27 44.7,28.98 U3.3
N$4
  SIGNAL1 0.254: U1.9 45.4,27.27 U3.4
N$5  (via drill 0.25)
  SIGNAL1 0.203: U1.32 39.73,18.77 | 39.73,18.77 39.55,18.59 | 36.2,24.2 36.45,23.95 | 36.45,23.95 v37,23.4 | v38.9,18.6 39.5,18.6 C118.1 39.73,18.77 | R101.2 36.45,23.95
  SIGNAL2 0.203: v37,23.4 38.5,21.9 38.5,19 v38.9,18.6
N$6  (3 unrouted)
  SIGNAL1 0.203: 33.5,17.1 34.3,17.1 37.8,20.6 38.7,20.6 39.2,21.1 39.23,21.1 U1.28 | 33.5,17.3 33.5,18.9 | C128.2 32.1,17.25 C127.2
N$7
  SIGNAL1 0.203: R102.2 33.5,24.9 34,24.4 C119.1
N$8
  SIGNAL1 0.203: U2.1 48.9,26.8
  SIGNAL1 0.356: 48.9,26.8 59,36.9 J2.1
N$9
  SIGNAL1 0.203: 45.2,30.4 45.2,30.32 U3.1
  SIGNAL1 0.356: 45.2,30.4 45.2,36.3 34.3,47.2 J3.1
N$10  (1 unrouted)
  SIGNAL1 0.203: 38.3,23.5 38.07,23.73 37.88,23.73 37.55,24.06 37.55,24.55 37.01,25.09 C120.1 36.6,25.5 35.9,24.8 R101.1 35.3,24.9 34.4,25.8 R102.1
N$11
  SIGNAL1 0.203: R43.1 80.2,13.9 | R41.2 80.2,12.5
  SIGNAL1 0.406: J4.1 80.2,12.4 80.2,12.5 80.2,13.9
N$12
  SIGNAL1 0.203: R47.1 73.5,18.9 | R45.2 74.72,16.1 | U4.5 74.7,17.7
  SIGNAL1 0.406: U4.5 74.72,16.1 | 73.5,18.9 74.7,17.7
N$13
  SIGNAL1 0.203: R46.2 74.72,22.5 | 73.5,20.3 R48.1 | 74.7,21.5 U4.4
  SIGNAL1 0.406: 73.5,20.3 74.7,21.5 | U4.4 74.72,22.5
N$14
  SIGNAL1 0.203: R45.1 76.67,16.1 76.8,15.7 | 80,15.7 R43.2
  SIGNAL1 0.406: U4.8 76.67,16.1 | 76.8,15.7 80,15.7
N$15
  SIGNAL1 0.203: R46.1 76.67,22.5 | R44.2 77.9,20.5 | U4.1 76.8,21.6
  SIGNAL1 0.406: U4.1 76.67,22.5 | 76.8,21.6 77.9,20.5
N$16
  SIGNAL1 0.203: R53.1 70,5 | 69.85,3.77 R51.2
  SIGNAL1 0.406: 69.85,3.77 R53.1 | J5.1 70,5
N$17
  SIGNAL1 0.406: R44.1 R42.2
N$18
  SIGNAL1 0.203: 66.1,11.47 R55.2 | U5.5 67.2,11.6 | 67.2,12.3 R57.1
  SIGNAL1 0.406: 67.2,12.3 67.2,11.6 | U5.5 66.1,11.47
N$19
  SIGNAL1 0.203: 72.5,11.47 R56.2 | 71.4,11.6 U5.4 | 68.6,13.5 R58.1
  SIGNAL1 0.305: 68.6,13.5 69.5,13.5 71.4,11.6
  SIGNAL1 0.406: 72.5,11.47 U5.4
N$20
  SIGNAL1 0.203: 66.1,9.53 R55.1 | 69.7,7 R53.2
  SIGNAL1 0.406: 66.1,9.53 U5.8 68.17,9.53 69.7,8 69.7,7
N$21
  SIGNAL1 0.203: 73,9.8 R56.1 72.5,9.53 | 73.8,9.8 R54.2
  SIGNAL1 0.406: 72.5,9.53 U5.1 | 73.8,9.8 73,9.8
N$22
  SIGNAL1 0.406: R54.1 R52.2
N$23
  SIGNAL1 0.203: R61.2 73.5,41.7 | R63.1 74.72,44.12 | U6.8 74.7,42.9
  SIGNAL1 0.406: 73.5,41.7 74.7,42.9 | U6.8 74.72,44.12
N$24
  SIGNAL1 0.203: 74.72,37.83 R64.1 | U6.1 74.7,39 | 73.5,40.2 R62.2
  SIGNAL1 0.406: R62.2 73.25,40.33 | 73.5,40.2 74.7,39 | U6.1 74.72,37.83
N$25
  SIGNAL1 0.203: 77.9,41.7 R65.1 | 76.8,42.8 U6.5 | 76.67,44.12 R63.2
  SIGNAL1 0.406: U6.5 76.67,44.12 | 77.9,41.7 76.8,42.8
N$26
  SIGNAL1 0.203: R64.2 76.67,37.83
  SIGNAL1 0.406: U6.4 76.67,37.83
N$27
  SIGNAL1 0.203: 79.2,39 R66.1
  SIGNAL1 0.406: R65.2 C64.1 79.2,39
N$28
  SIGNAL1 0.203: R71.2 73.5,29.1 | R73.1 74.72,31.57 | U7.8 74.7,30.3
  SIGNAL1 0.406: 73.5,29.1 74.7,30.3 | U7.8 74.72,31.57
N$29
  SIGNAL1 0.203: 79.2,37.6 R66.2
  SIGNAL1 0.406: J6.1 79.2,37.6
N$30
  SIGNAL1 0.203: R74.1 74.72,25.12 | U7.1 74.7,26.4 | 73.5,27.6 R72.2
  SIGNAL1 0.406: 73.5,27.6 74.7,26.4 | U7.1 74.72,25.12
N$31
  SIGNAL1 0.203: 77.9,29.1 R75.1 | 76.8,30.2 U7.5 | 76.67,31.57 R73.2
  SIGNAL1 0.406: U7.5 76.67,31.57 | 76.8,30.2 77.9,29.1
N$32
  SIGNAL1 0.203: R74.2 76.67,25.12
  SIGNAL1 0.406: 76.67,25.12 U7.4
N$33
  SIGNAL1 0.203: R76.1 79.2,26.55
  SIGNAL1 0.406: R75.2 C74.1 79.2,26.55
N$34
  SIGNAL1 0.203: 79.5,25 R76.2
  SIGNAL1 0.406: J7.1 79.5,25
N$35
  cutout SIGNAL1: 78.5,56.1 78.5,51 61,33.5 61,22.4 50.5,11.9 50.4,12 60.8,22.4 60.8,33.6 78.4,51.2 78.4,56.1
  cutout GND1: 78.5,56.1 78.5,51 61,33.5 61,22.4 50.5,11.9 50.4,12 60.8,22.4 60.8,33.6 78.4,51.2 78.4,56.1
  cutout SIGNAL2: 78.5,56.1 78.5,51 61,33.5 61,22.4 50.5,11.9 50.4,12 60.8,22.4 60.8,33.6 78.4,51.2 78.4,56.1
  cutout GND2: 78.5,56.1 78.5,51 61,33.5 61,22.4 50.5,11.9 50.4,12 60.8,22.4 60.8,33.6 78.4,51.2 78.4,56.1
  cutout SUPPLY: 78.5,56.1 78.5,51 61,33.5 61,22.4 50.5,11.9 50.4,12 60.8,22.4 60.8,33.6 78.4,51.2 78.4,56.1
  cutout GND3: 78.5,56.1 78.5,51 61,33.5 61,22.3 50.5,11.9 50.4,12 60.8,22.4 60.8,33.6 78.4,51.2 78.4,56.1
N$36  (3 unrouted)
  SIGNAL1 0.254: 31.9,22 33.4,20.5 | X2.3 30.85,21.45 29.1,19.7 29.1,18.2 28.5,17.6 28.5,10.65
N$37  (3 unrouted)
  SIGNAL1 0.406: C124.1 25.15,23.35 25,23.5 | C123.1 X2.4
N$38  (via drill 0.25)  (1 unrouted)
  SIGNAL1 0.203: U1.21 39.41,24.49 v38.8,25.1 | v33.3,11.6 33.3,11.5 33.2,11.4 31.1,11.4
  GND3 0.203: v33.3,11.6 33.3,20.4 38.1,25.2 38.7,25.2 v38.8,25.1
N$39
  SIGNAL1 0.203: X1.3 29.77,16.23 C128.1
N$40  (1 unrouted)
  SIGNAL1 0.203: U1.29 39.76,20.95 38.9,20.1 38,20.1 34.2,16.3 33.3,16.3 | C126.2 C127.1
N$41  (via drill 0.25 pad 0.25)
  other vias: 7.5,50.5
N$42  (via drill 0.25 pad 0.25)
  other vias: 10,51.5
N$43
  cutout SIGNAL1: 0,18.3 16.1,18.3 19.2,15.2 19.2,11.1 19.1,11.1 19.1,15.1 16,18.2 0,18.2
  cutout GND1: 0,18.3 16.1,18.3 19.2,15.2 19.2,11.1 19.1,11.1 19.1,15.1 16,18.2 0,18.2
  cutout SIGNAL2: 19.2,11.1 19.1,11.1 19.1,15.1 16,18.2 0,18.2 0,18.3 16.1,18.3 19.2,15.2
  cutout GND2: 16.1,18.3 19.2,15.2 19.2,11.1 19.1,11.1 19.1,15.1 16,18.2 0,18.2 0,18.3
  cutout SUPPLY: 19.2,15.2 19.2,11.1 19.1,11.1 19.1,15.1 16,18.2 0,18.2 0,18.3 16.1,18.3
  cutout GND3: 19.2,11.1 19.1,11.1 19.1,15.1 16,18.2 0,18.2 0,18.3 16.1,18.3 19.2,15.2
N$44  (via drill 0.25 pad 0.25)
  other vias: 17.5,51.5
N$45  (via drill 0.25 pad 0.25)
  other vias: 19,48.5
N$46  (via drill 0.25 pad 0.25)
  other vias: 14.5,45
N$47  (via drill 0.25 pad 0.25)
  other vias: 10.5,45
N$48  (via drill 0.25 pad 0.25)
  other vias: 3.5,34.5
N$49  (via drill 0.25 pad 0.25)
  other vias: 7,34
N$50  (via drill 0.25 pad 0.25)
  other vias: 14,35
N$51  (via drill 0.25 pad 0.25)
  other vias: 10.5,37.5
N$52  (via drill 0.25 pad 0.25)
  other vias: 14,39.5
N$53  (via drill 0.25 pad 0.25)
  other vias: 19,41.5
N$54  (via drill 0.25 pad 0.25)
  other vias: 23,45.5
N$55  (via drill 0.25 pad 0.25)
  other vias: 24.5,39.5
N$56  (via drill 0.25 pad 0.25)
  other vias: 24.5,37.5
N$57  (via drill 0.25 pad 0.25)
  other vias: 30,35.5
N$58  (via drill 0.25 pad 0.25)
  other vias: 31,40
N$59  (via drill 0.25 pad 0.25)
  other vias: 25.5,48
N$60  (via drill 0.25 pad 0.25)
  other vias: 32.5,52.5
N$61  (via drill 0.25 pad 0.25)
  other vias: 30.5,52.5
N$62  (via drill 0.25 pad 0.25)
  other vias: 23,53
N$63  (via drill 0.25 pad 0.25)
  other vias: 41.5,48
N$64  (via drill 0.25 pad 0.25)
  other vias: 37.5,48.5
N$65  (via drill 0.25 pad 0.25)
  other vias: 39.5,45.5
N$66  (via drill 0.25 pad 0.25)
  other vias: 38,38.5
N$67  (via drill 0.25 pad 0.25)
  other vias: 35,42.5
N$68  (via drill 0.25 pad 0.25)
  other vias: 38,35
N$69  (via drill 0.25 pad 0.25)
  other vias: 36.5,34
N$70  (via drill 0.25 pad 0.25)
  other vias: 24.5,33.5
N$71  (via drill 0.25 pad 0.25)
  other vias: 42,34
N$72  (via drill 0.25 pad 0.25)
  other vias: 51.5,35
N$73  (via drill 0.25 pad 0.25)
  other vias: 53,43.5
N$74  (via drill 0.25 pad 0.25)
  other vias: 47,47
N$75  (via drill 0.25 pad 0.25)
  other vias: 40,50
N$76  (via drill 0.25 pad 0.25)
  other vias: 42,53
N$77  (via drill 0.25 pad 0.25)
  other vias: 35.5,52.5
N$78  (via drill 0.25 pad 0.25)
  other vias: 36.5,54
N$79  (via drill 0.25 pad 0.25)
  other vias: 54.5,53
N$80  (via drill 0.25 pad 0.25)
  other vias: 49.5,49
N$81  (via drill 0.25 pad 0.25)
  other vias: 53,47.5
N$82  (via drill 0.25 pad 0.25)
  other vias: 56,39
N$83  (via drill 0.25 pad 0.25)
  other vias: 52,33
N$84  (via drill 0.25 pad 0.25)
  other vias: 49,38
N$85  (via drill 0.25 pad 0.25)
  other vias: 48.5,43
N$86  (via drill 0.25 pad 0.25)
  other vias: 46.5,44
N$87  (via drill 0.25 pad 0.25)
  other vias: 54.5,46
N$88  (via drill 0.25 pad 0.25)
  other vias: 50.5,47.5
N$89  (via drill 0.25 pad 0.25)
  other vias: 44,48.5
N$90  (via drill 0.25 pad 0.25)
  other vias: 59,52.5
N$91  (via drill 0.25 pad 0.25)
  other vias: 64.5,51.5
N$92  (via drill 0.25 pad 0.25)
  other vias: 63.5,53.5
N$93  (via drill 0.25 pad 0.25)
  other vias: 60,53.5
N$94  (via drill 0.25 pad 0.25)
  other vias: 69,48
N$95  (via drill 0.25 pad 0.25)
  other vias: 74,53.5
N$96  (via drill 0.25 pad 0.25)
  other vias: 64,45.5
N$97  (via drill 0.25 pad 0.25)
  other vias: 65,49.5
N$98  (via drill 0.25 pad 0.25)
  other vias: 68,43.5
N$99  (via drill 0.25 pad 0.25)
  other vias: 64.5,43
N$100  (via drill 0.25 pad 0.25)
  other vias: 61.5,40.5
N$101  (via drill 0.25 pad 0.25)
  other vias: 59.5,34
N$102  (via drill 0.25 pad 0.25)
  other vias: 53.5,27.5
N$103  (via drill 0.25 pad 0.25)
  other vias: 57.5,28
N$104  (via drill 0.25 pad 0.25)
  other vias: 58,24.5
N$105  (via drill 0.25 pad 0.25)
  other vias: 52.5,25.5
N$106  (via drill 0.25 pad 0.25)
  other vias: 54.5,25
N$107  (via drill 0.25 pad 0.25)
  other vias: 57.5,23
N$108  (via drill 0.25 pad 0.25)
  other vias: 29.5,29.5
N$109  (via drill 0.25 pad 0.25)
  other vias: 30.5,28.5
N$110  (via drill 0.25 pad 0.25)
  other vias: 31.5,29
N$111  (via drill 0.25 pad 0.25)
  other vias: 27.5,28
N$112  (via drill 0.25 pad 0.25)
  other vias: 21,23
N$113  (via drill 0.25 pad 0.25)
  other vias: 21,20.5
N$114  (via drill 0.25 pad 0.25)
  other vias: 19,22.5
N$115  (via drill 0.25 pad 0.25)
  other vias: 19.5,24
N$116  (via drill 0.25 pad 0.25)
  other vias: 17,21.5
N$117  (via drill 0.25 pad 0.25)
  other vias: 10.5,23
N$118  (via drill 0.25 pad 0.25)
  other vias: 2,22
N$119  (via drill 0.25 pad 0.25)
  other vias: 7.5,21.5
N$120  (via drill 0.25 pad 0.25)
  other vias: 15.5,20.5
N$121  (via drill 0.25 pad 0.25)
  other vias: 17.5,19
N$122  (via drill 0.25 pad 0.25)
  other vias: 13,2.5
N$123  (via drill 0.25 pad 0.25)
  other vias: 4.5,12
N$124  (via drill 0.25 pad 0.25)
  other vias: 2,15
N$125  (via drill 0.25 pad 0.25)
  other vias: 2.5,32.5
N$126  (via drill 0.25 pad 0.25)
  other vias: 5,40
N$127  (via drill 0.25 pad 0.25)
  other vias: 2,50
N$128  (via drill 0.25 pad 0.25)
  other vias: 20.5,45
N$129  (via drill 0.25 pad 0.25)
  other vias: 17,47.5
N$130  (via drill 0.25 pad 0.25)
  other vias: 14.5,43
N$131  (via drill 0.25 pad 0.25)
  other vias: 27.5,30
N$132  (via drill 0.25 pad 0.25)
  other vias: 30.5,27
N$133  (via drill 0.25 pad 0.25)
  other vias: 34,30.3
N$134  (via drill 0.25 pad 0.25)
  other vias: 58.5,31.5
N$135  (via drill 0.25 pad 0.25)
  other vias: 25,43
N$136  (via drill 0.25 pad 0.25)
  other vias: 11,40
N$137  (via drill 0.25 pad 0.25)
  other vias: 21.5,50.5
N$138  (via drill 0.25 pad 0.25)
  other vias: 59.5,27
N$139  (via drill 0.25 pad 0.25)
  other vias: 87,18
N$140  (via drill 0.25 pad 0.25)
  other vias: 87,32
N$141  (via drill 0.25 pad 0.25)
  other vias: 86,50.5
N$142  (via drill 0.25 pad 0.25)
  other vias: 69.5,31.5
N$143  (via drill 0.25 pad 0.25)
  other vias: 66.5,32.5
N$144  (via drill 0.25 pad 0.25)
  other vias: 13.5,27.5
N$145  (via drill 0.25 pad 0.25)
  other vias: 9.5,28
N$146  (via drill 0.25 pad 0.25)
  other vias: 7,30
N$147  (via drill 0.25 pad 0.25)
  other vias: 14.5,30
N$148  (via drill 0.25 pad 0.25)
  other vias: 22.5,27.5
N$149  (via drill 0.25 pad 0.25)
  other vias: 20.5,30
N$150  (via drill 0.25 pad 0.25)
  other vias: 23,24
N$151  (via drill 0.25 pad 0.25)
  other vias: 11,25
N$152  (via drill 0.25 pad 0.25)
  other vias: 4.5,26.5
RSSI  (via drill 0.25)
  SIGNAL1 0.203: v40.7,26.9 40.7,26.8 41,26.5 U1.16 | v40.7,13.6 41.5,12.8 41.5,8.8 43.5,6.8 v43.5,3.3
  SIGNAL2 0.203: v40.7,26.9 40.7,19 40.5,18.8 40.5,18.3 40.7,18.1 v40.7,13.6
  GND3 0.61: J1.39 v43.5,3.3
RXBBI+  (via drill 0.25)
  SIGNAL1 0.203: v49.5,10.5 43.8,16.2 43.8,17.9 44,18.1 44,18.5 43.9,18.6 U1.38
  GND3 0.61: J1.52 v49.5,10.5
RXBBI-  (via drill 0.25)
  SIGNAL1 0.203: v48.5,10.5 43.3,15.7 43.3,18.45 U1.37
  GND3 0.61: J1.50 v48.5,10.5
RXBBQ+  (via drill 0.25)
  SIGNAL1 0.203: v46.5,10.5 42.3,14.7 42.3,18.4 U1.36
  GND3 0.61: J1.46 v46.5,10.5
RXBBQ-  (via drill 0.25)
  SIGNAL1 0.203: v45.5,10.5 41.8,14.2 41.8,17.9 41.6,18.1 41.6,18.5 41.7,18.6 U1.35
  GND3 0.61: J1.44 v45.5,10.5
RXHP  (via drill 0.25, 0.25 pad 0.25)
  SIGNAL1 0.203: v45.1,18.1 45.1,18.83 U1.40
  SIGNAL1 0.254: v15.6,30.9 15.6,27.75 SW1.2
  GND3 0.203: v45.1,18.1 44.7,18.5 44.7,27 44.9,27.2 44.9,28.1 42.1,30.9 v15.6,30.9
RXTX  (via drill 0.25)
  SIGNAL1 0.203: v48.5,22.7 47.9,22.7 47.4,22.2 U1.48 | v36.8,11.3 36.8,10.1 35.5,8.8 v35.5,3.5
  GND3 0.203: v48.5,22.7 48.4,22.6 48.4,21.1 49,20.5 49,18.9 48.2,18.1 48.2,16.2 43.4,11.4 36.9,11.4 v36.8,11.3 | v35.5,3.5 J1.23
SCLK  (via drill 0.25)
  SIGNAL1 0.203: v39.6,27.2 39.6,26.5 40.3,25.8 U1.18
  GND3 0.203: v39.6,27.2 39.6,28 37.9,29.7 35.2,29.7 31.8,26.3 31.8,10.7 32.5,10 J1.18
TXBBI+  (via drill 0.25)
  SIGNAL1 0.203: v48.3,19.2 46.3,21.2 U1.45
  SIGNAL2 0.203: v43.5,10.5 48.3,15.3 v48.3,19.2
  GND3 0.61: J1.40 v43.5,10.5
TXBBI-  (via drill 0.25)
  SIGNAL1 0.203: v47.6,19.2 45.9,20.9 U1.44
  SIGNAL2 0.203: v42.5,10.5 47.6,15.6 v47.6,19.2
  GND3 0.61: J1.38 v42.5,10.5
TXBBQ+  (via drill 0.25)
  SIGNAL1 0.203: v46.9,19.2 45.6,20.5 U1.43
  SIGNAL2 0.203: v40.5,10.5 46.9,16.9 v46.9,19.2
  GND3 0.61: J1.34 v40.5,10.5
TXBBQ-  (via drill 0.25)
  SIGNAL1 0.203: v46.2,19.2 45.3,20.1 U1.42
  SIGNAL2 0.203: v39.5,10.5 46.2,17.2 v46.2,19.2
  GND3 0.61: J1.32 v39.5,10.5
V_BIAS_ADC  (via drill 0.25)
  SIGNAL1 0.203: 76.5,12.2 R452.2 | 76.5,12.2 76.2,12.1 | 76.5,12.2 C45.1 | 75.5,12.1 R451.1
  SIGNAL1 0.406: 75.5,12.1 76.2,12.1 | v76.5,13.9 76.5,12.2 | v76.5,20.2 76.03,20.68 U4.2 | U5.2 70.67,10.18 v70.2,9.7
  SUPPLY 0.406: v70.2,9.7 72.3,9.7 v76.5,13.9 v76.5,20.2
V_BIAS_DAC  (via drill 0.25)
  SIGNAL1 0.203: 75,34.9 R671.1 | R672.2 73.8,35.4 | 73.8,34.9 C67.1 73.5,34.4
  SIGNAL1 0.406: 75.22,39.77 v74.9,40.1 75.38,39.62 U6.2 | v74.9,27.5 75.38,27.02 U7.2 | 75,34.9 74.5,35.4 73.8,35.4 73.8,34.9 | 73.5,34.4 v74.1,33.8
  SUPPLY 0.406: v74.9,40.1 74.1,39.35 v74.1,33.8 74.1,28.3 v74.9,27.5
VSUP  (1 unrouted)
WP
  SIGNAL1 0.203: RWP1.2 14.35,9.9
  SIGNAL1 0.305: RWP1.2 RWP0.2 | 16.32,7.33 IC1.7 15.32,7.33 14.35,8.29 14.35,9.9

## Text on the board
tPlace: 2.4-2.5GHz | Baseband | TX/RX | RX | DAC3 | B7 | B6 | RXHP | ANTSEL | 0 | DAC4 | 1 | EEPROM setup | I2C address | 0 | 1 | A2 | A1 | ADC3 | A0 | write | protection | ADC4
bPlace: Rev | 7.5-18 MHz wide 2.4-2.5 GHz | and Baseband module | for the Marmote platform | Vanderbilt University, ISIS | Copyright c 2013 | http://marmote.googlecode.com